# EAGLE design poe (EAGLE 7.1.0)
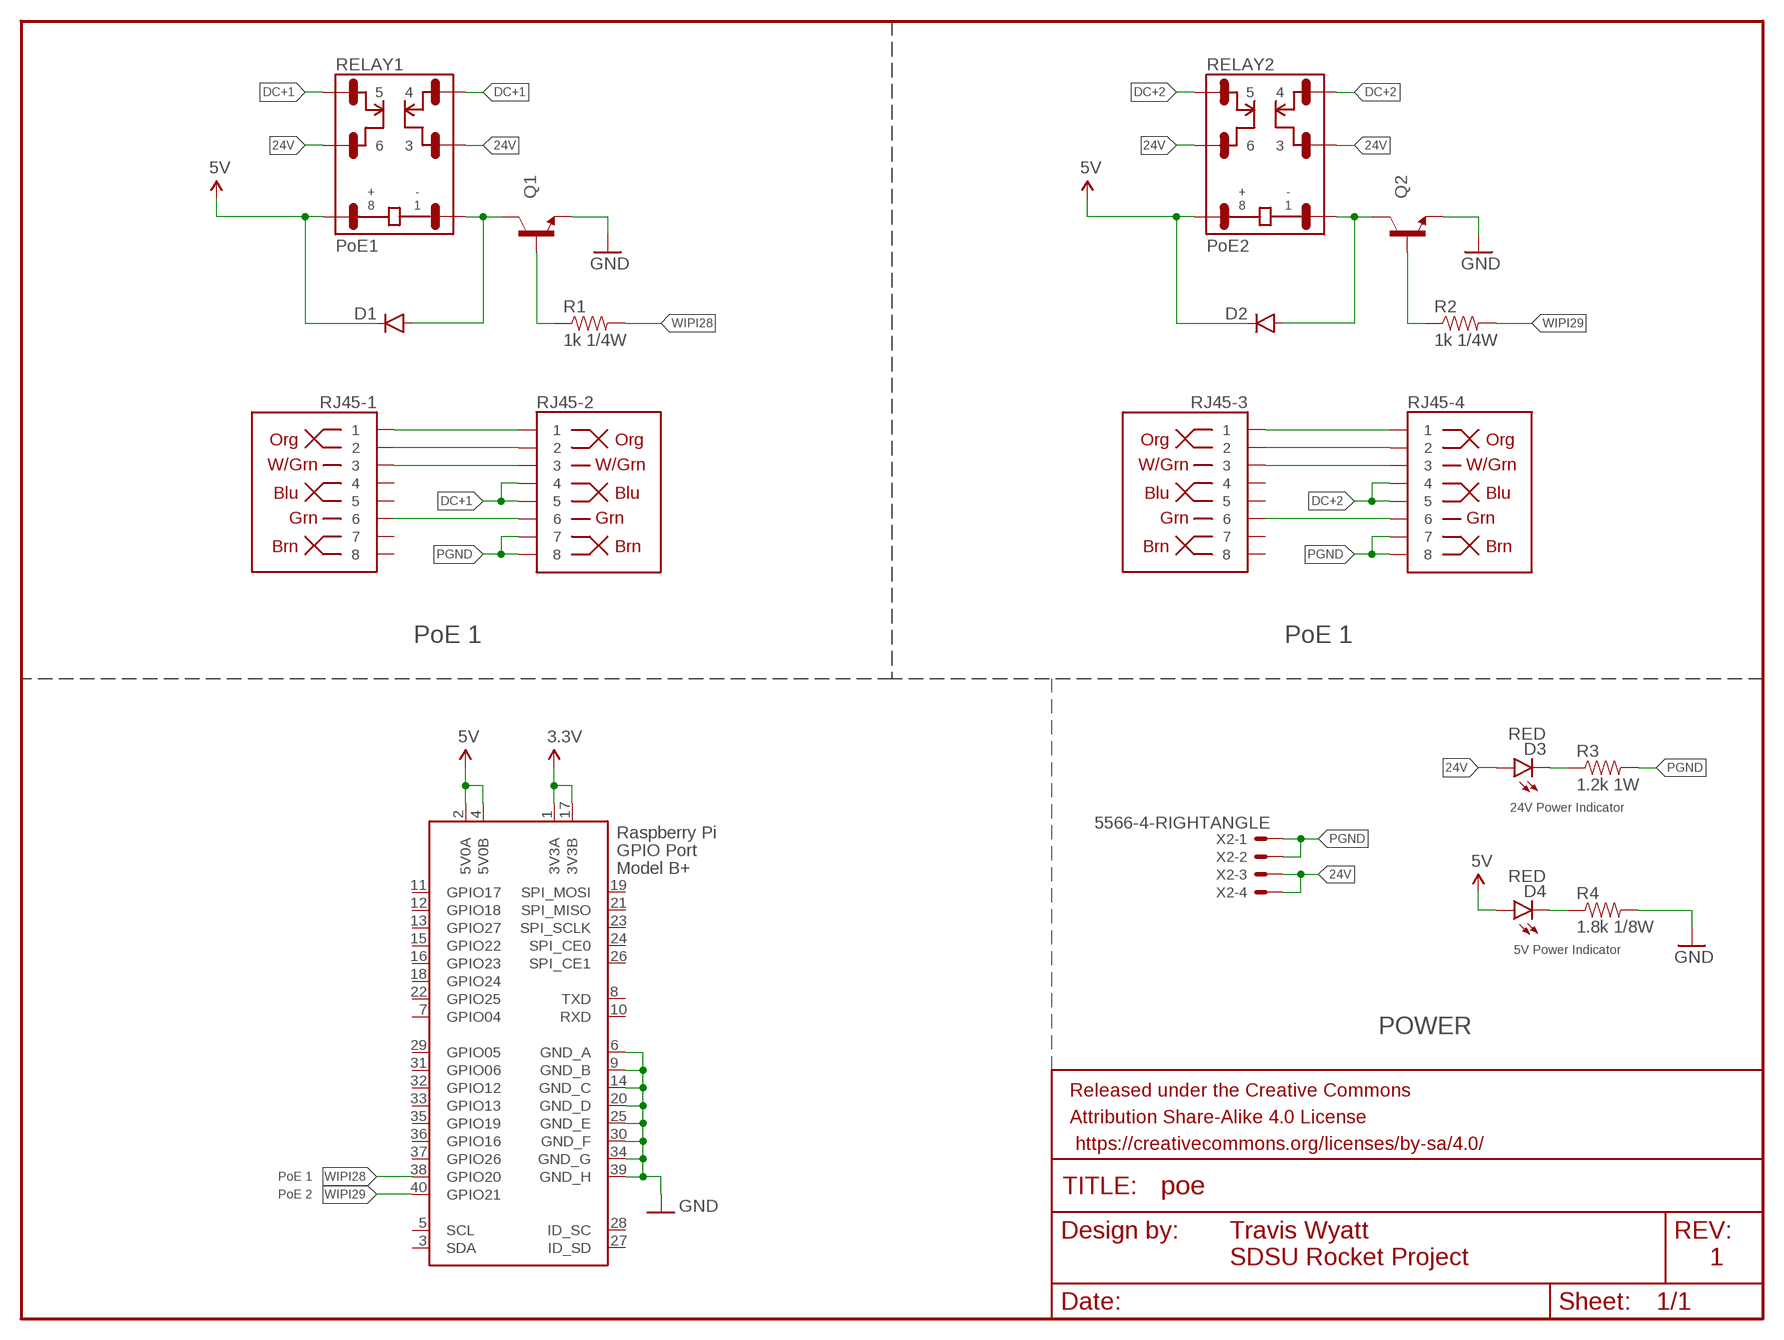
[diagram p0: schematic, sheet 1]

## Parts
D1  DIODESOD123  [SOD-123]
D2  DIODESOD123  [SOD-123]
D3  RED  LED0603  [LED-0603]
D4  RED  LED0603  [LED-0603]
FRAME1  FRAME-LETTER  [CREATIVE_COMMONS]
Q1  TRANSISTOR_NPNSOT23-3  [SOT23-3]
Q2  TRANSISTOR_NPNSOT23-3  [SOT23-3]
R1  1k 1/4W  RESISTOR0603-RES  [0603-RES]
R2  1k 1/4W  RESISTOR0603-RES  [0603-RES]
R3  1.2k 1W  RESISTOR2512  [R2512]
R4  1.8k 1/8W  RESISTOR0603-RES  [0603-RES]
RELAY1  PoE1  G6B-2014P-US  [G6B-2]
RELAY2  PoE2  G6B-2014P-US  [G6B-2]
RJ45-1  RJ45-8PTH  [RJ45-8]
RJ45-2  RJ45-8PTH  [RJ45-8]
RJ45-3  RJ45-8PTH  [RJ45-8]
RJ45-4  RJ45-8PTH  [RJ45-8]
X1  RASPI_BOARD_B+#_H  [RASPI_BOARD_B+HAT]
X2  5566-4-RIGHTANGLE  [5566-4]

## Nets
3.3V: X1.1(3V3A) X1.17(3V3B)
5V: D1.C D2.C D4.A RELAY1.8 RELAY2.8 X1.2(5V0A) X1.4(5V0B)
24V: D3.A RELAY1.3 RELAY1.6 RELAY2.3 RELAY2.6 X2.3 X2.4
DC+1: RELAY1.4 RELAY1.5 RJ45-2.4 RJ45-2.5
DC+2: RELAY2.4 RELAY2.5 RJ45-4.4 RJ45-4.5
GND: Q1.2(E) Q2.2(E) R4.2 X1.6(GND_A) X1.9(GND_B) X1.14(GND_C) X1.20(GND_D) X1.25(GND_E) X1.30(GND_F) X1.34(GND_G) X1.39(GND_H)
N$1: Q1.1(B) R1.1
N$2: D1.A Q1.3(C) RELAY1.1
N$3: D3.C R3.1
N$4: D4.C R4.1
N$5: D2.A Q2.3(C) RELAY2.1
N$6: Q2.1(B) R2.1
N$11: RJ45-1.1 RJ45-2.1
N$12: RJ45-1.2 RJ45-2.2
N$13: RJ45-1.3 RJ45-2.3
N$14: RJ45-1.6 RJ45-2.6
N$15: RJ45-3.1 RJ45-4.1
N$16: RJ45-3.2 RJ45-4.2
N$17: RJ45-3.3 RJ45-4.3
N$18: RJ45-3.6 RJ45-4.6
PGND: R3.2 RJ45-2.7 RJ45-2.8 RJ45-4.7 RJ45-4.8 X2.1 X2.2
WIPI28: R1.2 X1.38(GPIO20)
WIPI29: R2.2 X1.40(GPIO21)
Unconnected: RJ45-1.4 RJ45-1.5 RJ45-1.7 RJ45-1.8 RJ45-3.4 RJ45-3.5 RJ45-3.7 RJ45-3.8 X1.3(SDA) X1.5(SCL) X1.7(GPIO04) X1.8(TXD) X1.10(RXD) X1.11(GPIO17) X1.12(GPIO18) X1.13(GPIO27) X1.15(GPIO22) X1.16(GPIO23) X1.18(GPIO24) X1.19(SPI_MOSI) X1.21(SPI_MISO) X1.22(GPIO25) X1.23(SPI_SCLK) X1.24(SPI_CE0) X1.26(SPI_CE1) X1.27(ID_SD) X1.28(ID_SC) X1.29(GPIO05) X1.31(GPIO06) X1.32(GPIO12) X1.33(GPIO13) X1.35(GPIO19) X1.36(GPIO16) X1.37(GPIO26)

## Notes on the sheet
- PoE 1 | PoE 1
- 24V Power Indicator
- 5V Power Indicator
- POWER
- PoE 1
- PoE 2
- Travis Wyatt
- SDSU Rocket Project
- 1

## Library data of the parts
D1 D2 = SparkFun-DiscreteSemi:DIODE: Diode These are standard reverse protection diodes and small signal diodes. SMA package can handle up to about 1A. SOD-323 can handle about 200mA. What the SOD-323 package when ordering, there are some mfgs out there that are 5-pin packages.
D3 D4 = SparkFun-LED:LED: LEDs Standard schematic elements and footprints for 5mm, 3mm, 1206, and 0603 sized LEDs. 5mm - Spark Fun Electronics SKU : COM-00529 (and others)
FRAME1 = SparkFun-Aesthetics:FRAME-LETTER: Schematic Frame Standard 8.5x11 US Letter frame; DESIGNER: NAME; VERSION: v01
Q1 Q2 = SparkFun-DiscreteSemi:TRANSISTOR_NPN: Generic NPN BJT MMBT2222A - TRANS-08049 (SOT-23, 1A 40V) MPSA42 - TRANS-09116 (SOT-23, 500mA 300V) MMBT5088LT1G - TRANS-11160 (SOT-23, 50 mA 30V) BC547 - COM-08928 <http://www.sparkfun.com/products/8928> (TO-92 45V 100mA) (1.Collector 2.Base 3.Emitter) 2N3904 - COM-00521 <http://www.sparkfun.com/products/521> (TO-92 40V 200mA) (1.Emitter 2.Base 3.Collector) P2N2222A - COM-12852 <http://www.sparkfun.com/products/12852> (TO-92 40V 600mA) (1.Collector 2.Base 3.Emitter); PROD_ID: TRANS-08049
R1-R4 = SparkFun-Resistors:RESISTOR: Resistor Basic schematic elements and footprints for 0603, 1206, and PTH resistors.
RELAY1 RELAY2 = SDSURocket-Electromechanical:G6B-2
RJ45-1-RJ45-4 = SparkFun-Connectors:RJ45-8: RJ45 Jack Simple RJ45, 8-pin connection - connector for common Cat5, Cat5e, and Cat6 Ethernet cables. Footprint not yet proven in production. Connector sku is PRT-00643; Breakout PCB sku is BOB-00716.; PROD_ID: CONN-08506; VALUE: RJ45
X1 = raspberrypi_bastelstube_v13:RASPI_BOARD_B+#: Raspberry Pi GPIO connector with markings for the outer dimensions of the Raspberry Pi board model B+ with different sets of drill holes or mounting pads All pins connected
X2 = SDSURocket-Connectors:5566-4: Mini FIT connector 4 pol Source: http://www.molex.com; OC_FARNELL: unknown; OC_NEWARK: unknown

## Board
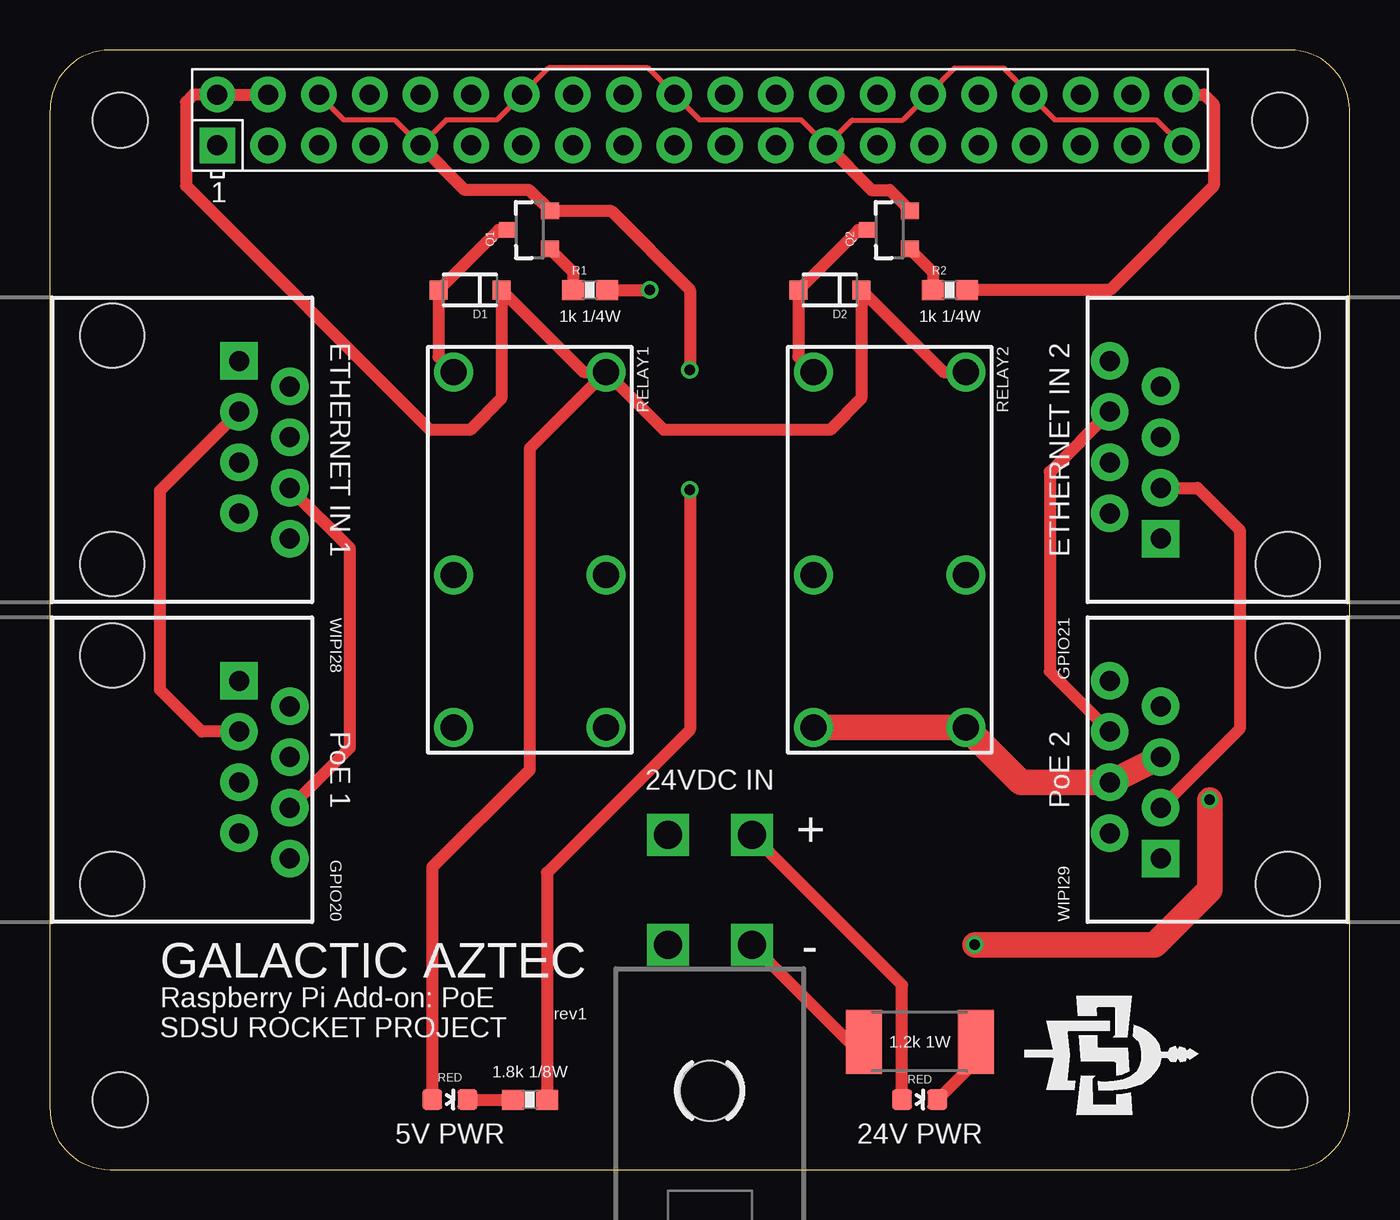
[diagram p1: board, top side]
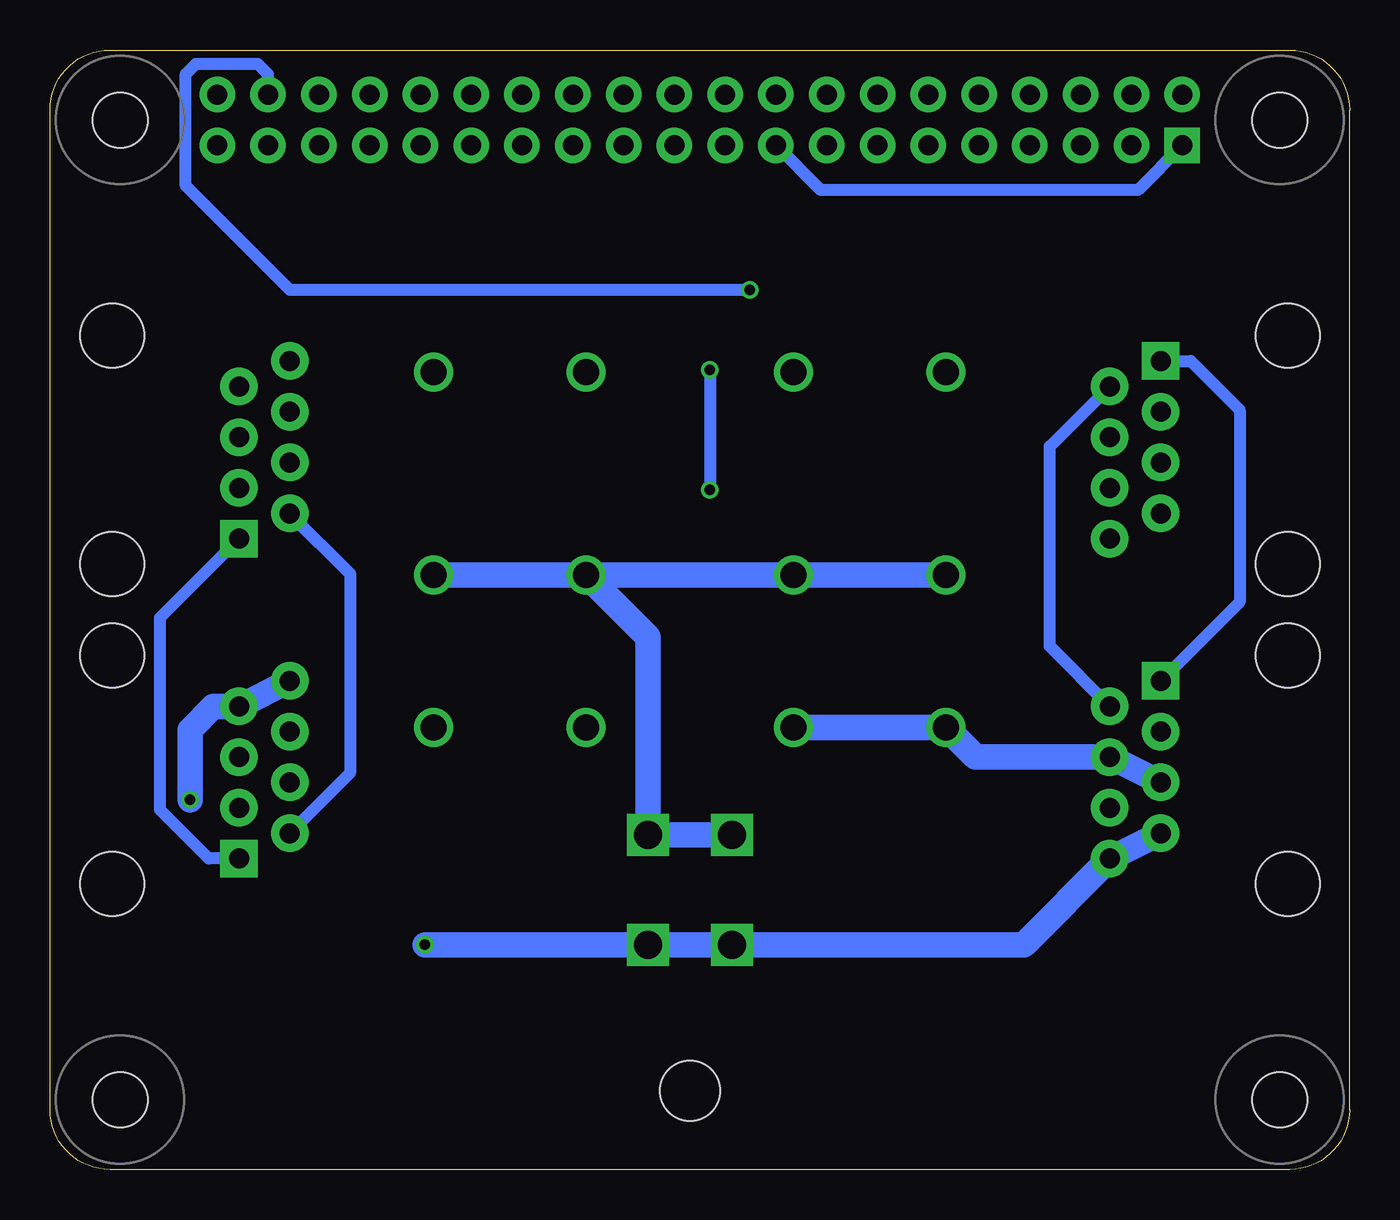
[diagram p2: board, bottom side, seen from below]

Size 65 x 56 mm. Coordinates in mm from the lower left corner, seen from the top.
Copper layers (1*16): Top 0.0356mm / dielectric 1.5011mm / Bottom 0.0356mm
Design rules "SparkFunBestPractices": minimum track width 10mil, minimum drill 13mil, track to track 10mil, track to pad 10mil, pad to pad 10mil, via to via 10mil, smd to smd 10mil, copper to edge 15mil, drill to drill 12mil, minimum pad ring 7mil, minimum via ring 7mil, stop-mask expansion 3mil, vias tented up to drill 0mil, thermal gap 10mil

### Footprints (pad centres in the part's own frame; a part is rotated, then mirrored left to right if it is on the bottom)
SOD-123 = smd 0.9 x 0.95: A 1.575,0; C -1.575,0
LED-0603 = smd 1 x 1: A 0,-0.877; C 0,0.877
SOT23-3 = smd 0.8 x 0.9: 1 -0.95,-1; 2 0.95,-1; 3 0,1.1
0603-RES = smd 1.1 x 1: 1 -0.85,0; 2 0.85,0
R2512 = smd 1.8 x 3.2: 1 -2.8,0; 2 2.8,0
G6B-2 = drill 1.3: 1 -8.89,-3.81; 3 1.27,-3.81; 4 8.89,-3.81; 5 8.89,3.81; 6 1.27,3.81; 8 -8.89,3.81
RJ45-8 = drill 1 pad 1.88 square: 1 -4.445,6.35 | drill 1 pad 1.88: 2 -3.175,8.89; 3 -1.905,6.35; 4 -0.635,8.89; 5 0.635,6.35; 6 1.905,8.89; 7 3.175,6.35; 8 4.445,8.89 | hole 3.2: -5.715,0; 5.715,0
RASPI_BOARD_B+HAT = drill 1 pad 1.778 square: 1 8.37,51.23 | drill 1 pad 1.778: 2 8.37,53.77; 3 10.91,51.23; 4 10.91,53.77; 5 13.45,51.23; 6 13.45,53.77; 7 15.99,51.23; 8 15.99,53.77; 9 18.53,51.23; 10 18.53,53.77; 11 21.07,51.23; 12 21.07,53.77; 13 23.61,51.23; 14 23.61,53.77; 15 26.15,51.23; 16 26.15,53.77; 17 28.69,51.23; 18 28.69,53.77; 19 31.23,51.23; 20 31.23,53.77; 21 33.77,51.23; 22 33.77,53.77; 23 36.31,51.23; 24 36.31,53.77; 25 38.85,51.23; 26 38.85,53.77; 27 41.39,51.23; 28 41.39,53.77; 29 43.93,51.23; 30 43.93,53.77; 31 46.47,51.23; 32 46.47,53.77; 33 49.01,51.23; 34 49.01,53.77; 35 51.55,51.23; 36 51.55,53.77; 37 54.09,51.23; 38 54.09,53.77; 39 56.63,51.23; 40 56.63,53.77 | hole 2.75: 3.5,3.5; 3.5,52.5; 61.5,3.5; 61.5,52.5
5566-4 = drill 1.4 square: 1 2.1,-2.75; 2 -2.1,-2.75; 3 2.1,2.75; 4 -2.1,2.75 | hole 3: 0,-10.05

### Placement (x,y rotation side)
D1  21,44 180 top
D2  39,44 180 top
D3  43.5,3.5 270 top
D4  20,3.5 270 top
FRAME1  0,-17 0 top  (outside the outline)
Q1  24,47 90 top
Q2  42,47 90 top
R1  27,44 0 top
R2  45,44 0 top
R3  43.5,6.4 180 top
R4  24,3.5 0 top
RELAY1  24,31 270 top
RELAY2  42,31 270 top
RJ45-1  3.1,36 270 top
RJ45-2  3.1,20 270 top
RJ45-3  61.9,36 90 top
RJ45-4  61.9,20 90 top
X1  0,0 0 top
X2  33,14 0 top

### Tracks (layer width: path | path; a pad name or v marks a point on that pad's centre or on a via)
3.3V
  Bottom 0.61: X1.1 10.6,49 26.46,49 X1.17
5V
  Top 0.61: RELAY1.8 26.68,39.89 D1.C 22.57,38.58 21,37 19,37 6.8,49.2 6.8,53.4 7.17,53.77 X1.2 X1.4 | RELAY2.8 44.69,39.89 D2.C 40.58,38.58 39,37 30.7,37 RELAY1.8 | RELAY1.8 24,36.08 24,20 19.12,15.12 D4.A
24V
  Top 0.61: D3.A 42.62,9.23 X2.3
  Bottom 1.27: RELAY1.3 RELAY1.6 RELAY2.3 | RELAY2.3 RELAY2.6 | X2.4 X2.3 35.1,26.64 RELAY2.3
DC+1
  Bottom 1.27: RELAY1.5 RELAY1.4 18.71,20.64 RJ45-2.4 RJ45-2.5
DC+2
  Top 1.27: RELAY2.4 RELAY2.5 48.55,19.36 RJ45-4.4 RJ45-4.5
GND  (via drill 0.51)
  Top 0.254: X1.6 14.72,52.5 17.26,52.5 X1.9 19.8,52.5 22.34,52.5 X1.14 24.94,55.1 29.9,55.1 X1.20 32.5,52.5 37.58,52.5 X1.25 40.12,52.5 42.66,52.5 X1.30 45.26,55.1 47.68,55.1 X1.34 50.28,52.5 55.36,52.5 X1.39
  Top 0.61: v32,34 32,22 24.85,14.85 R4.2 | X1.9 20.76,49 23.95,49 Q1.2 28.05,47.95 32,44 v32,40 | X1.25 41.08,49 42,49 43,48 Q2.2
  Bottom 0.61: v32,40 v32,34
N$1
  Top 0.61: Q1.1 26.15,44.9 R1.1
N$2
  Top 0.61: RELAY1.1 19.43,40.66 D1.A 22.43,47 Q1.3
N$3
  Top 0.61: D3.C 46.3,5.42 R3.1
N$4
  Top 0.61: D4.C R4.1
N$5
  Top 0.61: RELAY2.1 37.42,40.66 D2.A 40.42,47 Q2.3
N$6
  Top 0.61: Q2.1 44.15,44.9 R2.1
N$11
  Bottom 0.61: RJ45-1.1 7.95,40.45 5.5,38 5.5,28.39 RJ45-2.1
N$12
  Bottom 0.61: RJ45-2.2 15,26.18 15,36.16 RJ45-1.2
N$13
  Top 0.61: RJ45-2.3 7.59,21.91 5.5,24 5.5,33.95 RJ45-1.3
N$14
  Top 0.61: RJ45-2.6 15,21.11 15,31.09 RJ45-1.6
N$15
  Bottom 0.61: RJ45-4.1 57.05,15.55 59.5,18 59.5,27.61 RJ45-3.1
N$16
  Bottom 0.61: RJ45-3.2 50,29.82 50,19.84 RJ45-4.2
N$17
  Top 0.61: RJ45-3.3 57.41,34.09 59.5,32 59.5,22.05 RJ45-4.3
N$18
  Top 0.61: RJ45-3.6 50,34.9 50,24.91 RJ45-4.6
PGND  (via drill 0.51)
  Top 0.61: X2.1 39.95,6.4 R3.2
  Top 1.27: v58,18.5 58,14 55.25,11.25 v46.25,11.25
  Bottom 1.27: v58,18.5 58,22 56.83,23.18 RJ45-4.7 RJ45-4.8 | v46.25,11.25 X2.1 X2.2 16.3,11.25 RJ45-2.8 RJ45-2.7
WIPI28  (via drill 0.51)
  Top 0.61: R1.2 v30,44
  Bottom 0.61: v30,44 53,44 58.2,49.2 58.2,54.8 57.7,55.3 54.6,55.3 54.09,54.79 X1.38
WIPI29
  Top 0.61: X1.40 57.73,53.77 58.2,53.3 58.2,49.2 53,44 R2.2

### Text on the board
tNames: ETHERNET IN 1 | ETHERNET IN 2 | WIPI28 | GPIO21 | PoE 1 | 24VDC IN | PoE 2 | + | GPIO20 | WIPI29 | - | GALACTIC AZTEC | Raspberry Pi Add-on: PoE | rev1 | SDSU ROCKET PROJECT | 5V PWR | 24V PWR